# Altium schematic sheet usb_connectors.SchDoc
size A4; DocumentNumber: 8; SheetNumber: 8; SheetTotal: 9
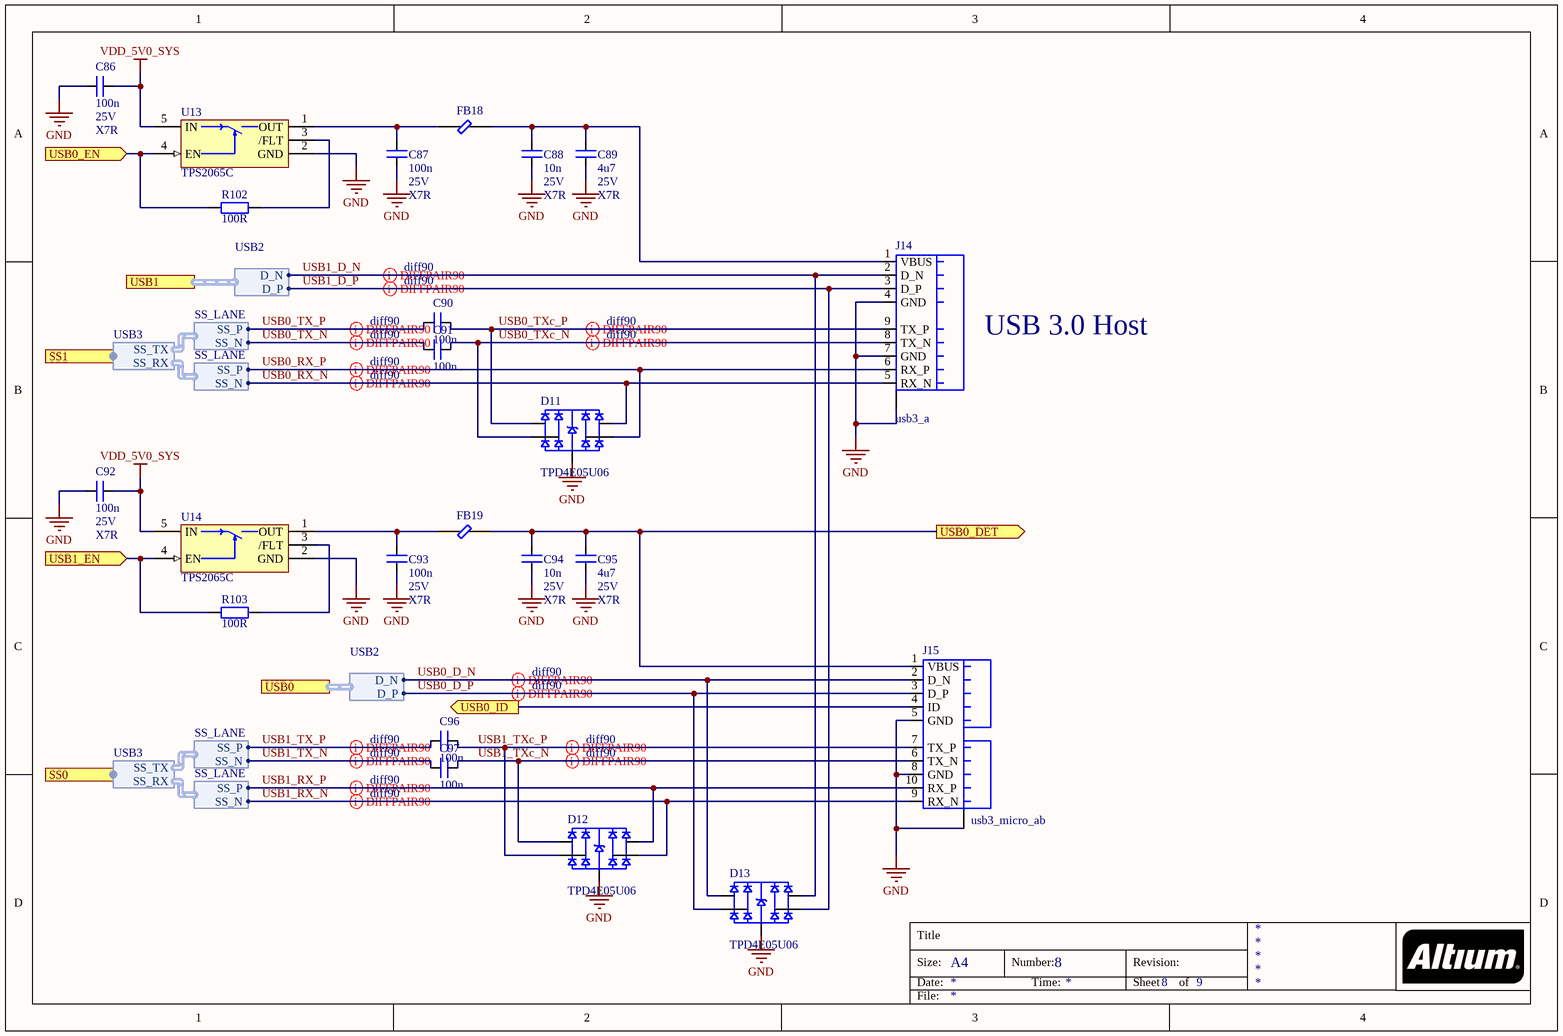
[diagram p0: usb_connectors.SchDoc]

## Parts
C86  value 100n  Voltage: 25V  Type: X7R  [C1005[0402]]  (hidden comment: cap)
C87  value 100n  Voltage: 25V  Type: X7R  [C1005[0402]]  (hidden comment: cap)
C88  value 10n  Voltage: 25V  Type: X7R  [C1005[0402]]  (hidden comment: cap)
C89  value 4u7  Voltage: 25V  Type: X7R  [C3216[1206]]  (hidden comment: cap)
C90  value 100n  [C1005[0402]]  (hidden comment: cap)
C91  value 100n  [C1005[0402]]  (hidden comment: cap)
C92  value 100n  Voltage: 25V  Type: X7R  [C1005[0402]]  (hidden comment: cap)
C93  value 100n  Voltage: 25V  Type: X7R  [C1005[0402]]  (hidden comment: cap)
C94  value 10n  Voltage: 25V  Type: X7R  [C1005[0402]]  (hidden comment: cap)
C95  value 4u7  Voltage: 25V  Type: X7R  [C3216[1206]]  (hidden comment: cap)
C96  value 100n  [C1005[0402]]  (hidden comment: cap)
C97  value 100n  [C1005[0402]]  (hidden comment: cap)
D11  TPD4E05U06  [TI_PSON50P100X55-10N]
D12  TPD4E05U06  [TI_PSON50P100X55-10N]
D13  TPD4E05U06  [TI_PSON50P100X55-10N]
FB18  2506036007Y3  [FBC1608X07N]  (value not drawn)
FB19  2506036007Y3  [FBC1608X07N]  (value not drawn)
J14  usb3_a  [usb3_a]
J15  usb3_micro_ab  [usb3_micro_ab]
R102  value 100R  [R1005[0402]]  (hidden comment: res)
R103  value 100R  [R1005[0402]]  (hidden comment: res)
U13  TPS2065C  [TI_SOT95P280X145-5N]
U14  TPS2065C  [TI_SOT95P280X145-5N]

## Ports
SS0 (harness USB3), SS1 (harness USB3), USB0 (harness USB2), USB0_DET (out), USB0_EN (in), USB0_ID (out), USB1 (harness USB2), USB1_EN (in)

## Harnesses
USB2: D_P, D_N
USB3: SS_TX, SS_RX
SS_LANE: SS_P, SS_N

## Nets
GND: C86.2 C87.1 C88.1 C89.1 C92.2 C93.1 C94.1 C95.1 D11.3(GND) D12.3(GND) D13.3(GND) J14.4(GND) J14.7(GND) J14.SHIELD J15.5(GND) J15.8(GND) J15.SHIELD U13.2(GND) U14.2(GND)
VDD_5V0_SYS: C86.1 C92.1 U13.5(IN) U14.5(IN)
USB0_D_N: D13.1(D1+) J15.2(D_N) ; port USB0.D_N
USB0_D_P: D13.2(D1-) J15.3(D_P) ; port USB0.D_P
USB0_DET: C94.2 C95.2 FB19.2 J15.1(VBUS) ; port USB0_DET
USB0_EN: R102.1 U13.4(EN) ; port USB0_EN
USB0_ID: J15.4(ID) ; port USB0_ID
USB0_RX_N: D11.5(D2+) J14.5(RX_N) ; harness SS_LANE.SS_N
USB0_RX_P: D11.4(D2-) J14.6(RX_P) ; harness SS_LANE.SS_P
USB0_TX_N: C91.2 ; harness SS_LANE.SS_N
USB0_TX_P: C90.2 ; harness SS_LANE.SS_P
USB0_TXc_N: C91.1 D11.2(D1-) J14.8(TX_N)
USB0_TXc_P: C90.1 D11.1(D1+) J14.9(TX_P)
USB1_D_N: D13.5(D2+) J14.2(D_N) ; port USB1.D_N
USB1_D_P: D13.4(D2-) J14.3(D_P) ; port USB1.D_P
USB1_EN: R103.1 U14.4(EN) ; port USB1_EN
USB1_RX_N: D12.4(D2-) J15.9(RX_N) ; harness SS_LANE.SS_N
USB1_RX_P: D12.5(D2+) J15.10(RX_P) ; harness SS_LANE.SS_P
USB1_TX_N: C97.2 ; harness SS_LANE.SS_N
USB1_TX_P: C96.2 ; harness SS_LANE.SS_P
USB1_TXc_N: C97.1 D12.1(D1+) J15.6(TX_N)
USB1_TXc_P: C96.1 D12.2(D1-) J15.7(TX_P)
NetC87_2: C87.2 FB18.1 U13.1(OUT)
NetC88_2: C88.2 C89.2 FB18.2 J14.1(VBUS)
NetC93_2: C93.2 FB19.1 U14.1(OUT)
NetR102_2: R102.2 U13.3(/FLT)
NetR103_2: R103.2 U14.3(/FLT)

## Layout directives
differential pair; net class diff90: USB0_D_N, USB0_D_P, USB0_RX_N, USB0_RX_P, USB0_TX_N, USB0_TX_P, USB0_TXc_N, USB0_TXc_P, USB1_D_N, USB1_D_P, USB1_RX_N, USB1_RX_P, USB1_TX_N, USB1_TX_P, USB1_TXc_N, USB1_TXc_P

## Notes on the sheet
- USB 3.0 Host
- Title
- Size:
- Date:
- A4
- Number:
- Time:
- Revision:
- Sheet
- of
- File:

## Library data of the parts
C86-C89 C92-C95 = cap: Capacitor; Manufacturer: *; Series: *
C90 C91 C96 C97 = cap: Capacitor; Voltage: 25V; Type: X7R; Manufacturer: *; Series: *
FB18 FB19 = ferrite_bead: Ferrite bead
R102 R103 = res: Resistor